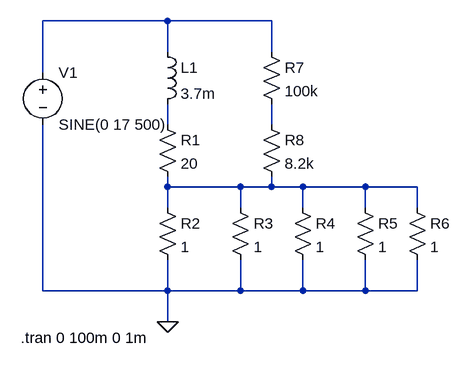
[diagram p0: schematic AnalogDraft_1.asc]
AnalogDraft_1.asc, the LTspice schematic file:
Version 4
SHEET 1 880 680
WIRE 160 32 -32 32
WIRE 320 32 160 32
WIRE 160 80 160 32
WIRE 320 80 320 32
WIRE -32 112 -32 32
WIRE 160 192 160 160
WIRE 320 192 320 160
WIRE 160 288 160 272
WIRE 272 288 160 288
WIRE 320 288 320 272
WIRE 320 288 272 288
WIRE 368 288 320 288
WIRE 464 288 368 288
WIRE 544 288 464 288
WIRE 160 320 160 288
WIRE 272 320 272 288
WIRE 368 320 368 288
WIRE 464 320 464 288
WIRE 544 320 544 288
WIRE -32 448 -32 192
WIRE 160 448 160 400
WIRE 160 448 -32 448
WIRE 272 448 272 400
WIRE 272 448 160 448
WIRE 368 448 368 400
WIRE 368 448 272 448
WIRE 464 448 464 400
WIRE 464 448 368 448
WIRE 544 448 544 400
WIRE 544 448 464 448
WIRE 160 496 160 448
FLAG 160 496 0
SYMBOL voltage -32 96 R0
WINDOW 123 0 0 Left 2
WINDOW 39 0 0 Left 2
SYMATTR InstName V1
SYMATTR Value SINE(0 17 500)
SYMBOL ind 144 64 R0
SYMATTR InstName L1
SYMATTR Value 3.7m
SYMBOL res 144 176 R0
SYMATTR InstName R1
SYMATTR Value 20
SYMBOL res 144 304 R0
SYMATTR InstName R2
SYMATTR Value 1
SYMBOL res 256 304 R0
SYMATTR InstName R3
SYMATTR Value 1
SYMBOL res 352 304 R0
SYMATTR InstName R4
SYMATTR Value 1
SYMBOL res 448 304 R0
SYMATTR InstName R5
SYMATTR Value 1
SYMBOL res 528 304 R0
SYMATTR InstName R6
SYMATTR Value 1
SYMBOL res 304 64 R0
SYMATTR InstName R7
SYMATTR Value 100k
SYMBOL res 304 176 R0
SYMATTR InstName R8
SYMATTR Value 8.2k
TEXT -66 520 Left 2 !.tran 0 100m 0 1m

The netlist it stands for:
* AnalogDraft_1.asc
V1 N001 0 SINE(0 17 500)
L1 N001 N002 3.7m
R1 N002 N004 20
R2 N004 0 1
R3 N004 0 1
R4 N004 0 1
R5 N004 0 1
R6 N004 0 1
R7 N001 N003 100k
R8 N003 N004 8.2k
.tran 0 100m 0 1m
.backanno
.end